# EAGLE design ATtinyAdapter (EAGLE 8.0.1)
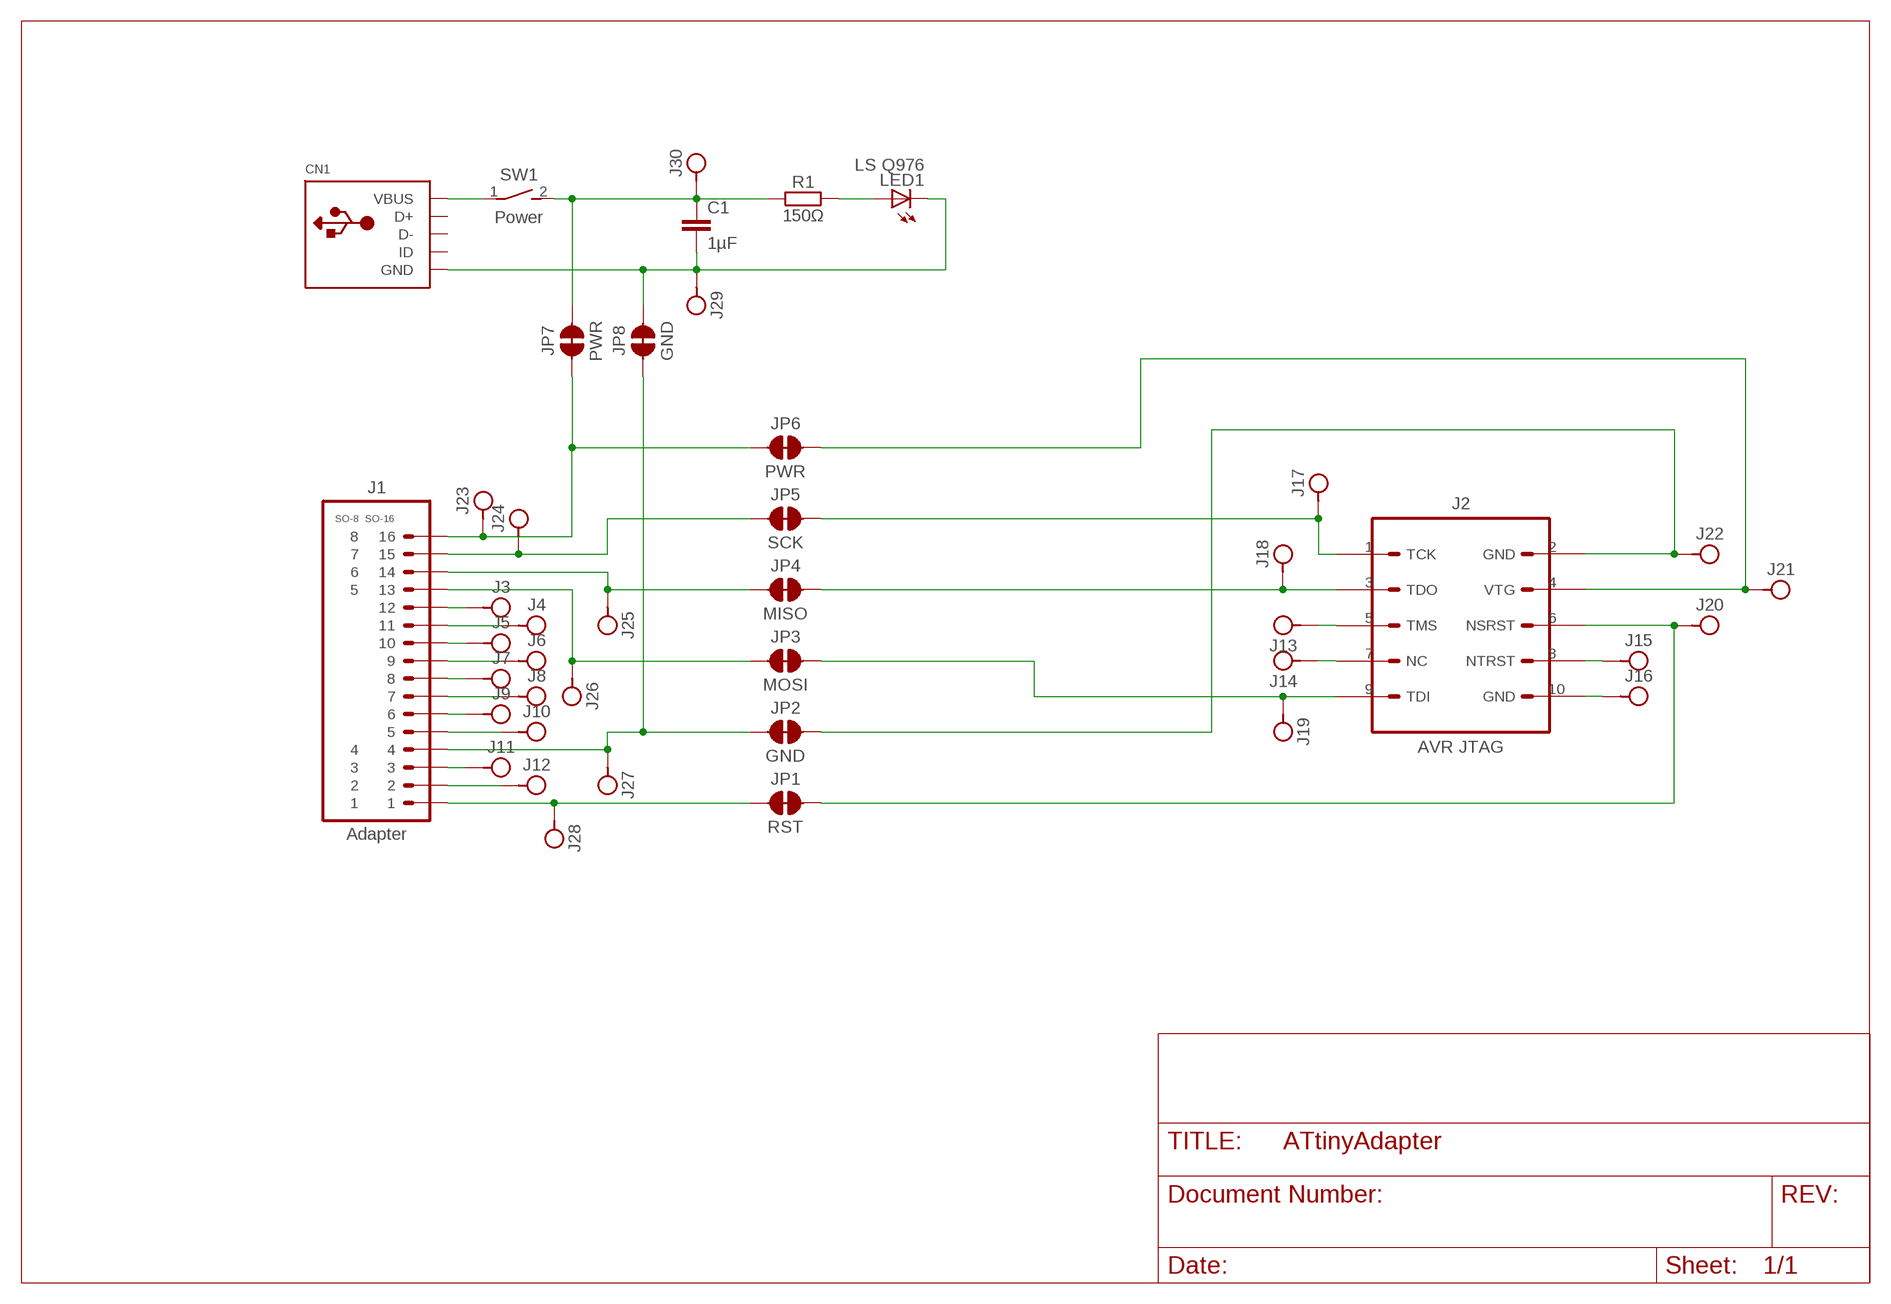
[diagram p0: schematic, sheet 1]

## Parts
C1  1µF  C0805  [RESISTOR_0805]
CN1  USBMINIB  [USB-MINIB-HSUAN-MAO-C8320-05BFDIB0R]
J1  Adapter  ELNEC-ZIP-ADAPTER-16P  [ELNEC-ZIF-ADAPTER-16P]
J2  AVR JTAG  CON-AVR-JTAG-SMD1.27  [CON-2X5-HARWIN-1.27]
J3  CON_SOLDER_POINT  [CON_SOLDER_POINT]
J4  CON_SOLDER_POINT  [CON_SOLDER_POINT]
J5  CON_SOLDER_POINT  [CON_SOLDER_POINT]
J6  CON_SOLDER_POINT  [CON_SOLDER_POINT]
J7  CON_SOLDER_POINT  [CON_SOLDER_POINT]
J8  CON_SOLDER_POINT  [CON_SOLDER_POINT]
J9  CON_SOLDER_POINT  [CON_SOLDER_POINT]
J10  CON_SOLDER_POINT  [CON_SOLDER_POINT]
J11  CON_SOLDER_POINT  [CON_SOLDER_POINT]
J12  CON_SOLDER_POINT  [CON_SOLDER_POINT]
J13  CON_SOLDER_POINT  [CON_SOLDER_POINT]
J14  CON_SOLDER_POINT  [CON_SOLDER_POINT]
J15  CON_SOLDER_POINT  [CON_SOLDER_POINT]
J16  CON_SOLDER_POINT  [CON_SOLDER_POINT]
J17  CON_SOLDER_POINT  [CON_SOLDER_POINT]
J18  CON_SOLDER_POINT  [CON_SOLDER_POINT]
J19  CON_SOLDER_POINT  [CON_SOLDER_POINT]
J20  CON_SOLDER_POINT  [CON_SOLDER_POINT]
J21  CON_SOLDER_POINT  [CON_SOLDER_POINT]
J22  CON_SOLDER_POINT  [CON_SOLDER_POINT]
J23  CON_SOLDER_POINT  [CON_SOLDER_POINT]
J24  CON_SOLDER_POINT  [CON_SOLDER_POINT]
J25  CON_SOLDER_POINT  [CON_SOLDER_POINT]
J26  CON_SOLDER_POINT  [CON_SOLDER_POINT]
J27  CON_SOLDER_POINT  [CON_SOLDER_POINT]
J28  CON_SOLDER_POINT  [CON_SOLDER_POINT]
J29  CON_SOLDER_POINT  [CON_SOLDER_POINT]
J30  CON_SOLDER_POINT  [CON_SOLDER_POINT]
JP1  RST  JUMPER-SMD-ON  [JUMPER-SMD-ON]
JP2  GND  JUMPER-SMD-ON  [JUMPER-SMD-ON]
JP3  MOSI  JUMPER-SMD-ON  [JUMPER-SMD-ON]
JP4  MISO  JUMPER-SMD-ON  [JUMPER-SMD-ON]
JP5  SCK  JUMPER-SMD-ON  [JUMPER-SMD-ON]
JP6  PWR  JUMPER-SMD-ON  [JUMPER-SMD-ON]
JP7  PWR  JUMPER-SMD-ON  [JUMPER-SMD-ON]
JP8  GND  JUMPER-SMD-ON  [JUMPER-SMD-ON]
LED1  LS Q976  LEDCHIPLED_0603  [CHIPLED_0603]
R1  150Ω  RESISTOR0805  [RESISTOR_0805]
SW1  Power  SWITCH-ON-OFF02_3P_10.2X4.0  [SWITCH_02_3P_10.2X4.0]

## Nets
JTAG1: J2.1(TCK) J17.1 JP5.2
JTAG2: J2.2(GND) J22.1 JP2.2
JTAG3: J2.3(TDO) J18.1 JP4.2
JTAG4: J2.4(VTG) J21.1 JP6.2
JTAG5: J2.5(TMS) J13.1
JTAG6: J2.6(NSRST) J20.1 JP1.2
JTAG7: J2.7(NC) J14.1
JTAG8: J2.8(NTRST) J15.1
JTAG9: J2.9(TDI) J19.1 JP3.2
JTAG10: J2.10(GND) J16.1
N$1: J1.1 J28.1 JP1.1
N$2: LED1.A R1.2
N$3: C1.2 CN1.GND J29.1 JP8.2 LED1.C
N$5: J1.16 J23.1 JP6.1 JP7.1
N$7: CN1.VBUS SW1.1
N$8: J1.14 J25.1 JP4.1
N$10: J1.15 J24.1 JP5.1
N$12: J1.13 J26.1 JP3.1
N$14: J1.4 J27.1 JP2.1 JP8.1
N$15: C1.1 J30.1 JP7.2 R1.1 SW1.2(S)
N$16: J1.12 J3.1
N$17: J1.11 J4.1
N$18: J1.10 J5.1
N$19: J1.9 J6.1
N$20: J1.8 J7.1
N$21: J1.7 J8.1
N$22: J1.6 J9.1
N$23: J1.5 J10.1
N$24: J1.3 J11.1
N$25: J1.2 J12.1
Unconnected: CN1.D+ CN1.D- CN1.ID

## Library data of the parts
C1 = lucky-resistor:C
CN1 = lucky-resistor:USB: USB B Mini Connector
J1 = lucky-resistor:ELNEC-ZIP-ADAPTER-16P
J2 = lucky-resistor:CON-AVR-JTAG: AVR JTAG Connector
J3-J30 = lucky-resistor:CON_SOLDER_POINT
JP1-JP8 = lucky-resistor:JUMPER-SMD-ON: A connected jumper
LED1 = adafruit:LED: LED OSRAM: - CHIPLED LG R971, LG N971, LY N971, LG Q971, LY Q971, LO R971, LY R971 LH N974, LH R974 LS Q976, LO Q976, LY Q976 LO Q996 - Hyper CHIPLED LW Q18S LB Q993, LB Q99A, LB R99A - SideLED LS A670, LO A670, LY A670, LG A670, LP A670 LB A673, LV A673, LT A673, LW A673 LH A674 LY A675 LS A676, LA A676, LO A676, LY A676, LW A676 LS A679, LY A679, LG A679 - Hyper Micro SIDELED® LS Y876, LA Y876, LO Y876, LY Y876 LT Y87S - SmartLED LW L88C, LW L88S LB L89C, LB L89S, LG L890 LS L89K, LO L89K, LY L89K LS L896, LA L896, LO L896, LY L896 - TOPLED LS T670, LO T670, LY T670, LG T670, LP T670 LSG T670, LSP T670, LSY T670, LOP T670, LYG T670 LG T671, LOG T671, LSG T671 LB T673, LV T673, LT T673, LW T673 LH T674 LS T676, LA T676, LO T676, LY T676, LB T676, LH T676, LSB T676, LW T676 LB T67C, LV T67C, LT T67C, LS T67K, LO T67K, LY T67K, LW E67C LS E67B, LA E67B, LO E67B, LY E67B, LB E67C, LV E67C, LT E67C LW T67C LS T679, LY T679, LG T679 LS T770, LO T770, LY T770, LG T770, LP T770 LB T773, LV T773, LT T773, LW T773 LH T774 LS E675, LA E675, LY E675, LS T675 LS T776, LA T776, LO T776, LY T776, LB T776 LHGB T686 LT T68C, LB T68C - Hyper Mini TOPLED® LB M676 - Mini TOPLED Santana® LG M470 LS M47K, LO M47K, LY M47K Source: http://www.osram.convergy.de/
R1 = lucky-resistor:RESISTOR
SW1 = lucky-resistor:SWITCH-ON-OFF

## Board
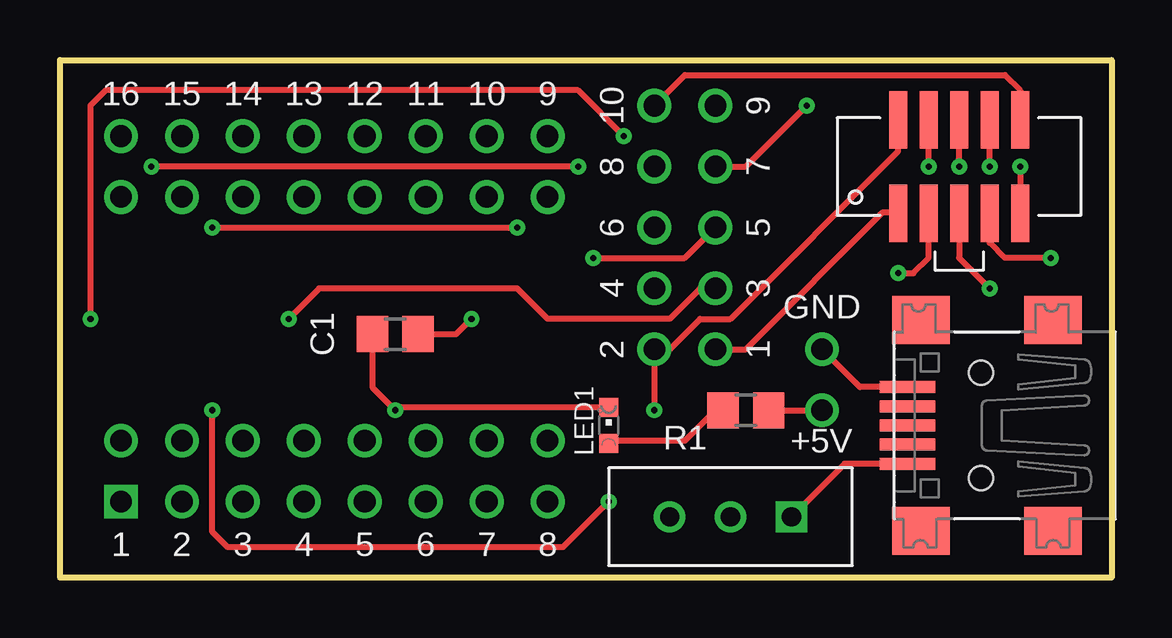
[diagram p1: board, top side]
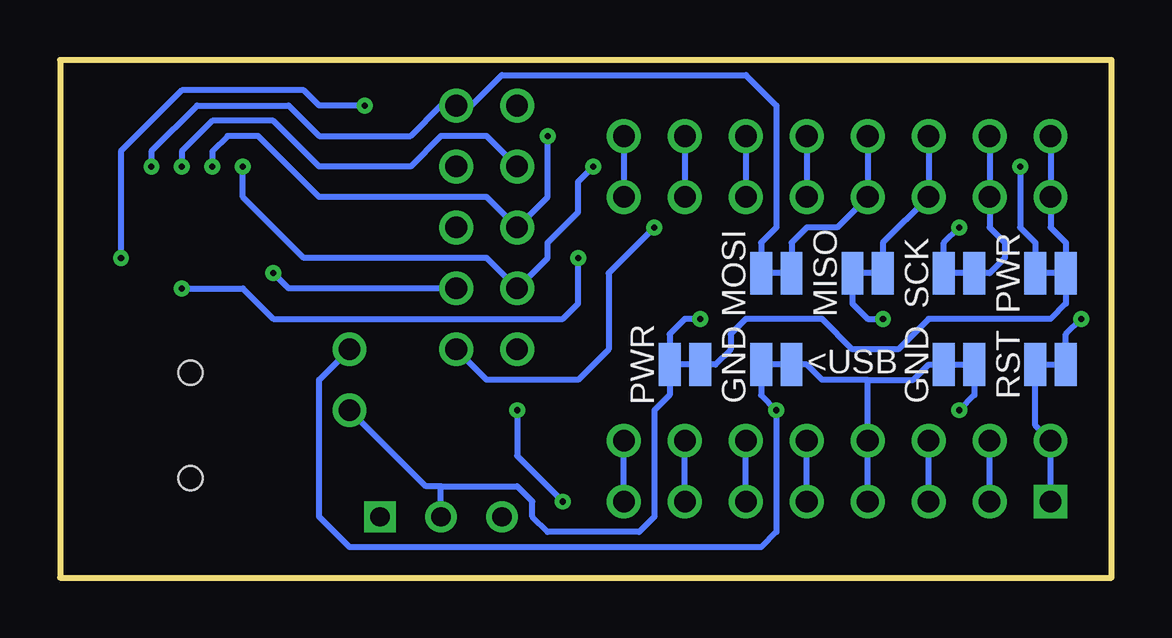
[diagram p2: board, bottom side, seen from below]

Size 43.81 x 21.59 mm. Coordinates in mm from the lower left corner, seen from the top.
Outline: 0,0 0,21.59 43.81,21.59 43.81,0 0,0
Copper layers (1*16): Top 0.035mm / dielectric 1.5mm / Bottom 0.035mm
Design rules "default": minimum track width 10mil, minimum drill 24mil, track to track 8mil, track to pad 8mil, pad to pad 8mil, via to via 8mil, smd to smd 8mil, copper to edge 40mil, drill to drill 8mil, minimum pad ring 10mil, minimum via ring 8mil, stop-mask expansion 4mil, vias tented up to drill 0mil, thermal gap 10mil

### Footprints (pad centres in the part's own frame; a part is rotated, then mirrored left to right if it is on the bottom)
RESISTOR_0805 = smd 1.3 x 1.5: 1 -0.95,0; 2 0.95,0
USB-MINIB-HSUAN-MAO-C8320-05BFDIB0R = smd 0.5 x 2.308: D+ 0,4.064; D- -0.8,4.064; GND 1.6,4.064; ID 0.8,4.064; VBUS -1.6,4.064 | smd 2 x 2.4: GND1 -4.4,-2; GND2 -4.4,3.5; GND3 4.4,3.5; GND4 4.4,-2 | hole 1: -2.2,1; 2.2,1
ELNEC-ZIF-ADAPTER-16P = drill 0.9 square: 1 -8.89,-7.62 | drill 0.9: 2 -6.35,-7.62; 3 -3.81,-7.62; 4 -1.27,-7.62; 5 1.27,-7.62; 6 3.81,-7.62; 7 6.35,-7.62; 8 8.89,-7.62; 9 8.89,7.62; 10 6.35,7.62; 11 3.81,7.62; 12 1.27,7.62; 13 -1.27,7.62; 14 -3.81,7.62; 15 -6.35,7.62; 16 -8.89,7.62
CON-2X5-HARWIN-1.27 = smd 0.76 x 2.4: 1 -2.54,-1.95; 2 -2.54,1.95; 3 -1.27,-1.95; 4 -1.27,1.95; 5 0,-1.95; 6 0,1.95; 7 1.27,-1.95; 8 1.27,1.95; 9 2.54,-1.95; 10 2.54,1.95
CON_SOLDER_POINT = drill 0.9: 1 0,0
JUMPER-SMD-ON = smd 0.914 x 1.778: 1 -0.635,0; 2 0.635,0
CHIPLED_0603 = smd 0.8 x 0.8: A 0,-0.75; C 0,0.75
SWITCH_02_3P_10.2X4.0 = drill 0.8 square: 1 -2.54,0 | drill 0.8: 2 0,0; 3 2.54,0

### Placement (x,y rotation side)
C1  13.97,10.16 180 top
CN1  39.37,6.35 90 top
J1  11.43,10.79 0 top
J2  37.47,17.14 0 top
J3  12.7,15.88 0 top
J4  15.24,15.88 0 top
J5  17.78,15.88 0 top
J6  20.32,15.88 0 top
J7  20.32,5.71 0 top
J8  17.78,5.71 0 top
J9  15.24,5.71 0 top
J10  12.7,5.71 0 top
J11  7.62,5.71 0 top
J12  5.08,5.71 0 top
J13  27.3,14.61 90 top
J14  27.3,17.14 90 top
J15  24.77,17.14 90 top
J16  24.77,19.68 90 top
J17  27.3,9.53 90 top
J18  27.3,12.06 90 top
J19  27.3,19.68 90 top
J20  24.77,14.61 90 top
J21  24.77,12.06 90 top
J22  24.77,9.53 90 top
J23  2.54,15.88 0 top
J24  5.08,15.88 0 top
J25  7.62,15.88 0 top
J26  10.16,15.88 0 top
J27  10.16,5.71 0 top
J28  2.54,5.71 0 top
J29  31.75,9.53 0 top
J30  31.75,6.99 0 top
JP1  2.54,8.89 0 bottom
JP2  6.35,8.89 0 bottom
JP3  13.97,12.7 180 bottom
JP4  10.16,12.7 180 bottom
JP5  6.35,12.7 180 bottom
JP6  2.54,12.7 180 bottom
JP7  17.78,8.89 180 bottom
JP8  13.97,8.89 180 bottom
LED1  22.86,6.35 0 top
R1  28.57,6.99 180 top
SW1  27.94,2.54 180 top

### Tracks (layer width: path | path; a pad name or v marks a point on that pad's centre or on a via)
JTAG1  (via drill 0.25)
  Top 0.254: J17.1 28.57,9.53 34.29,15.24 34.88,15.24 J2.1 | v6.35,14.61 v19.05,14.61
  Bottom 0.254: JP5.2 6.99,13.97 v6.35,14.61 | v19.05,14.61 20.95,12.7 20.95,9.53 22.23,8.26 26.04,8.26 J17.1
JTAG2  (via drill 0.25)
  Top 0.254: J2.2 34.92,17.78 27.94,10.79 26.67,10.79 25.4,9.53 J22.1 v24.77,6.99 | v22.86,3.17 20.95,1.27 6.99,1.27 6.35,1.91 v6.35,6.99
  Bottom 0.254: JP2.2 5.71,7.62 v6.35,6.99 | v24.77,6.99 24.77,5.08 v22.86,3.17
JTAG3  (via drill 0.25)
  Top 0.254: v34.92,12.7 35.56,12.7 36.2,13.34 J2.3 | J18.1 26.67,12.06 25.4,10.79 20.32,10.79 19.05,12.06 10.79,12.06 v9.53,10.79
  Bottom 0.254: J18.1 34.29,12.06 v34.92,12.7 | JP4.2 10.79,11.43 10.16,10.79 v9.53,10.79
JTAG4  (via drill 0.25)
  Top 0.254: v36.2,17.14 J2.4 | v21.59,17.14 v3.81,17.14
  Bottom 0.254: v36.2,17.14 36.2,15.88 33.66,13.34 26.04,13.34 J21.1 23.5,13.34 23.5,13.97 22.23,15.24 22.23,16.51 v21.59,17.14 | v3.81,17.14 3.81,14.61 3.17,13.97 JP6.2
JTAG5  (via drill 0.25)
  Top 0.254: J2.5 37.47,13.34 v38.73,12.06 | v22.23,13.34 26.04,13.34 J13.1
  Bottom 0.254: v38.73,12.06 36.2,12.06 34.92,10.79 22.86,10.79 22.23,11.43 v22.23,13.34
JTAG6  (via drill 0.25)
  Top 0.254: v37.47,17.14 J2.6 | v23.5,18.41 21.59,20.32 1.91,20.32 1.27,19.68 v1.27,10.79
  Bottom 0.254: v37.47,17.14 37.47,17.78 36.83,18.41 35.56,18.41 33.02,15.88 26.04,15.88 J20.1 23.5,15.88 v23.5,18.41 | JP1.2 1.91,10.16 v1.27,10.79
JTAG7  (via drill 0.25)
  Top 0.254: J14.1 28.57,17.14 v31.11,19.68 | v41.27,13.34 39.37,13.34 38.73,13.97 J2.7
  Bottom 0.254: v31.11,19.68 33.02,19.68 33.66,20.32 38.73,20.32 41.27,17.78 v41.27,13.34
JTAG8  (via drill 0.25)
  Top 0.254: v38.73,17.14 J2.8
  Bottom 0.254: J15.1 26.04,18.41 27.94,18.41 29.21,17.14 33.02,17.14 34.92,19.05 37.47,19.05 38.73,17.78 v38.73,17.14
JTAG9  (via drill 0.25)
  Top 0.254: v40.01,17.14 J2.9
  Bottom 0.254: v40.01,17.14 40.01,17.78 38.1,19.68 34.29,19.68 33.02,18.41 29.21,18.41 27.94,19.68 J19.1 26.67,19.68 25.4,20.95 15.24,20.95 13.97,19.68 13.97,14.61 14.61,13.97 JP3.2
JTAG10
  Top 0.254: J16.1 26.04,20.95 39.37,20.95 40.01,20.32 J2.10
N$1
  Bottom 0.254: J1.1 J28.1 3.17,6.35 JP1.1
N$2
  Top 0.254: R1.2 27.3,6.99 26.04,5.71 22.98,5.71 LED1.A
N$3  (via drill 0.25)
  Top 0.254: CN1.GND 33.33,7.95 J29.1 | C1.2 13.02,7.93 v13.97,6.99 14.09,7.1 LED1.C
  Bottom 0.254: JP8.2 14.61,7.62 v13.97,6.99 13.97,1.91 14.61,1.27 31.75,1.27 33.02,2.54 33.02,8.26 J29.1
N$5
  Bottom 0.254: J1.16 J23.1 2.54,14.61 1.91,13.97 JP6.1 1.91,11.43 2.54,10.79 7.62,10.79 8.89,9.53 10.79,9.53 12.06,10.79 15.24,10.79 15.88,10.16 15.88,9.53 16.51,8.89 JP7.1
N$7
  Top 0.254: CN1.VBUS 32.69,4.75 SW1.1
N$8
  Bottom 0.254: J1.14 J25.1 9.53,13.97 JP4.1
N$10
  Bottom 0.254: J1.15 J24.1 5.08,14.61 4.45,13.97 4.45,13.34 5.08,12.7 JP5.1
N$12
  Bottom 0.254: J1.13 J26.1 11.43,14.61 12.7,14.61 13.34,13.97 JP3.1
N$14
  Bottom 0.254: J1.4 J27.1 10.16,8.26 | 10.16,8.26 8.26,8.26 7.62,8.89 JP2.1 | 10.16,8.26 12.06,8.26 12.7,8.89 JP8.1
N$15  (via drill 0.25)
  Top 0.254: C1.1 16.51,10.16 v17.14,10.79 | R1.1 J30.1
  Bottom 0.254: v17.14,10.79 17.78,10.79 18.41,10.16 JP7.2 18.41,7.62 19.05,6.99 19.05,2.54 19.68,1.91 23.5,1.91 24.13,2.54 24.13,3.17 24.77,3.81 27.94,3.81 | J30.1 28.57,3.81 27.94,3.81 | SW1.2 27.94,3.81
N$16
  Bottom 0.254: J1.12 J3.1
N$17
  Bottom 0.254: J1.11 J4.1
N$18
  Bottom 0.254: J1.10 J5.1
N$19
  Bottom 0.254: J1.9 J6.1
N$20
  Bottom 0.254: J1.8 J7.1
N$21
  Bottom 0.254: J1.7 J8.1
N$22
  Bottom 0.254: J1.6 J9.1
N$23
  Bottom 0.254: J1.5 J10.1
N$24
  Bottom 0.254: J1.3 J11.1
N$25
  Bottom 0.254: J1.2 J12.1

### Text on the board
tPlace: 16 | 15 | 14 | 13 | 12 | 11 | 10 | 9 | 10 | 9 | 8 | 7 | 6 | 5 | 4 | 3 | GND | 2 | 1 | +5V | 1 | 2 | 3 | 4 | 5 | 6 | 7 | 8
bPlace: <USB